# Altium project USB_Wireless_2.4G.PrjPcb
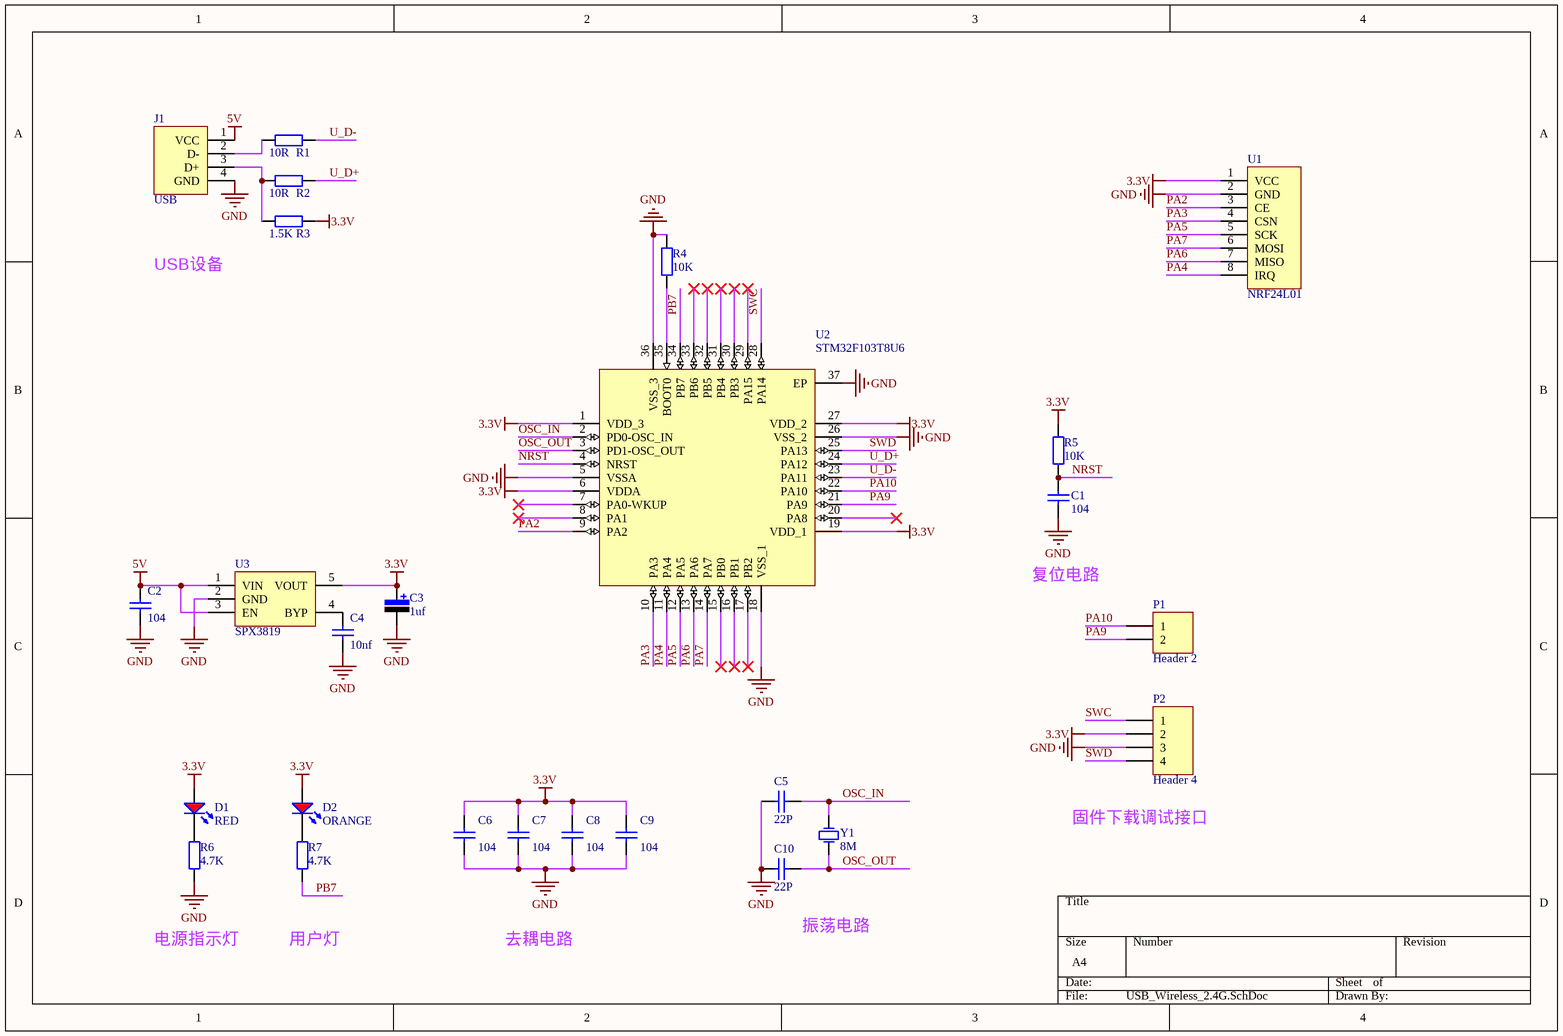
[diagram p0: USB_Wireless_2.4G.SchDoc]
1 sheet, 26 parts. Net scope: global (net labels, ports and power ports of the same name join across sheets).
Board file: USB_Wireless_2.4G.PcbDoc

## Sheet USB_Wireless_2.4G.SchDoc
size A4

### Parts
C1  104  [Cap-0603]
C2  104  [Cap-0603]
C3  1uf  [CAP-tan-3216]
C4  10nf  [Cap-0603]
C5  22P  [Cap-0603]
C6  104  [Cap-0603]
C7  104  [Cap-0603]
C8  104  [Cap-0603]
C9  104  [Cap-0603]
C10  22P  [Cap-0603]
D1  RED  [LED-0603]
D2  ORANGE  [LED-0603]
J1  USB  [USB贴片鱼叉型公头]
P1  Header 2  [HDR1X2]
P2  Header 4  [HDR1X4]
R1  10R  [Res-0603]
R2  10R  [Res-0603]
R3  1.5K  [Res-0603]
R4  10K  [Res-0603]
R5  10K  [Res-0603]
R6  4.7K  [Res-0603]
R7  4.7K  [Res-0603]
U1  NRF24L01  [NRF24L01]
U2  STM32F103T8U6  [STM-VFQFPN36_L]
U3  SPX3819  [SOT23-5]
Y1  8M  [XTAL_8M_5032]

### Nets
3.3V: C3.1 C6.2 C7.2 C8.2 C9.2 D1.1(A) D2.1(A) P2.2 R3.1 R5.2 U1.1(VCC) U2.1(VDD_3) U2.6(VDDA) U2.19(VDD_1) U2.27(VDD_2) U3.5(VOUT)
5V: C2.2 J1.1(VCC) U3.1(VIN) U3.3(EN)
GND: C1.1 C2.1 C3.2 C4.1 C5.1 C6.1 C7.1 C8.1 C9.1 C10.1 J1.4(GND) P2.3 R4.2 R6.1 U1.2(GND) U2.5(VSSA) U2.18(VSS_1) U2.26(VSS_2) U2.36(VSS_3) U2.37(EP) U3.2(GND)
NRST: C1.2 R5.1 U2.4(NRST)
OSC_IN: C5.2 U2.2(PD0-OSC_IN) Y1.1(OSC1)
OSC_OUT: C10.2 U2.3(PD1-OSC_OUT) Y1.2(OSC2)
PA2: U1.3(CE) U2.9(PA2)
PA3: U1.4(CSN) U2.10(PA3)
PA4: U1.8(IRQ) U2.11(PA4)
PA5: U1.5(SCK) U2.12(PA5)
PA6: U1.7(MISO) U2.13(PA6)
PA7: U1.6(MOSI) U2.14(PA7)
PA9: P1.2 U2.21(PA9)
PA10: P1.1 U2.22(PA10)
PB7: R7.1 U2.34(PB7)
SWC: P2.1 U2.28(PA14)
SWD: P2.4 U2.25(PA13)
U_D+: R2.1 U2.24(PA12)
U_D-: R1.1 U2.23(PA11)
NetC4_2: C4.2 U3.4(BYP)
NetD1_2: D1.2(K) R6.2
NetD2_2: D2.2(K) R7.2
NetJ1_2: J1.2(D-) R1.2
NetJ1_3: J1.3(D+) R2.2 R3.2
NetR4_1: R4.1 U2.35(BOOT0)

Not connected (* = marked no-connect by the designer): U2 7(PA0-WKUP)* 8(PA1)* 15(PB0)* 16(PB1)* 17(PB2)* 20(PA8)* 29(PA15)* 30(PB3)* 31(PB4)* 32(PB5)* 33(PB6)*

### Notes on the sheet
- USB设备
- 复位电路
- (near P2) 固件下载调试接口
- 电源指示灯
- 用户灯
- 去耦电路
- 振荡电路

### Library data of the parts
C1 C2 C4-C10 = Cap
C3 = Cap+
D1 D2 = LED
P1 = Header 2: Header, 2-Pin; LatestRevisionDate: 17-Jul-2002; LatestRevisionNote: Re-released for DXP Platform.; Publisher: Altium Limited
P2 = Header 4: Header, 4-Pin; LatestRevisionDate: 17-Jul-2002; LatestRevisionNote: Re-released for DXP Platform.; Publisher: Altium Limited
R1-R7 = Res
U2 = STM32F103T8U6: ARM Cortex-M3 32-bit MCU, 64 KB Flash, 20 KB Internal RAM, 26 I/Os, 36-pin VFQFPN, -40 to 85 degC, Tray; A/D Converter: 2x12-bit (10 Channel); FLASH Size (Prog) (kB): 64; I/Os (High Current): 26; Internal RAM Size (kB): 20; Operating Frequency(F) (Processor speed) (MHz): 72; Supply Voltage(Vcc) min (V): 2; DatasheetVersion: Rev. 16; PackageVersion: Rev. 16, 08/2013; PackageReference: VFQFPN36; PackageDescription: 36-Pin Quad Flat No-Lead, 6 x 6 x 1.0 mm Body, 0.5 mm Pitch, Exposed Pad; Supplier 1: Digi-Key; Supplier Part Number 1: 497-11532-ND; Supplier 2: Farnell; Supplier Part Number 2: 1606329; Supplier 3: Newark; Supplier Part Number 3: 11N8298; Supplier 4: Mouser; Supplier Part Number 4: 511-STM32F103T8U6; Core: ARM Cortex-M3; Packing: Tray; Mounting Technology: Surface Mount; PartNumber: STM32F103T8U6; ComponentLink1Description: Manufacturer URL; ComponentLink1URL: http://www.st.com/web/en/home.html; ComponentLink2Description: Datasheet; ComponentLink2URL: http://www.st.com/st-web-ui/static/active/en/resource/technical/document/datasheet/CD00161566.pdf; ComponentLink3Description: Package Specification; ComponentLink3URL: http://www.st.com/st-web-ui/static/active/en/resource/technical/document/datasheet/CD00161561.pdf
Y1 = XTAL